# Altium schematic sheet Sheet1.SchDoc
size A
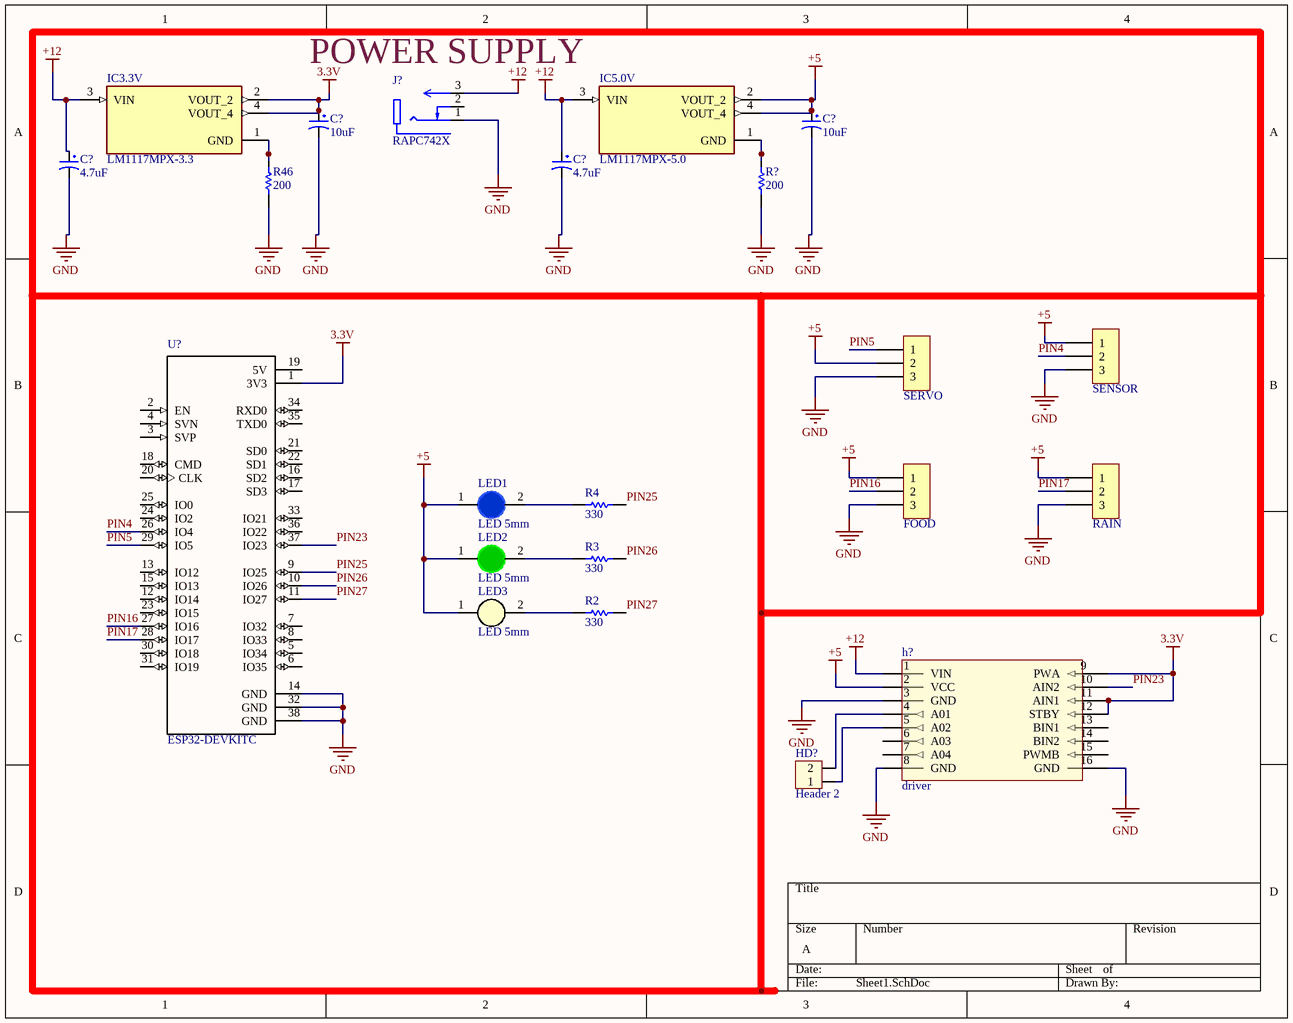
[diagram p0: Sheet1.SchDoc]

## Parts
(Parts that share a designator on the sheet are numbered #1, #2 ... from top to bottom, then left to right.)
C?#1  10uF  [tu hoa 4mm]
C?#2  10uF  [tu hoa 4mm]
C?#3  4.7uF  [tu hoa 4mm]
C?#4  4.7uF  [tu hoa 4mm]
H?#1  SENSOR  [VH3.96M-3]
H?#2  SERVO  [VH3.96M-3]
H?#3  FOOD  [VH3.96M-3]
H?#4  RAIN  [VH3.96M-3]
h?#5  driver  [driver - duplicate3]
HD?  Header 2  [HED2]
IC3.3V  LM1117MPX-3.3  [VREG_LM1117MPX-3.3]
IC5.0V  LM1117MPX-5.0  [VREG_LM1117MPX-3.3]
J?  RAPC742X  [SWITCHCRAFT_RAPC742X]
LED1  LED 5mm  [LED-5MM-BLUE]
LED2  LED 5mm  [LED-5MM-Green]
LED3  LED 5mm  [LED-5MM-WHITE]
R2  value 330  [R1/4W]  (hidden comment: Res1)
R3  value 330  [R1/4W]  (hidden comment: Res1)
R4  value 330  [R1/4W]  (hidden comment: Res1)
R46  value 200  [R1/4W]  (hidden comment: Res1)
R?  value 200  [R1/4W]  (hidden comment: Res1)
U?  ESP32-DEVKITC  [*XCVR_ESP32-DEVKITC]

## Nets
3.3V: C?#1.1 h?#5.9(PWA) h?#5.11(AIN1) h?#5.12(STBY) IC3.3V.2(VOUT_2) IC3.3V.4(VOUT_4) U?.1(3V3)
+5: C?#2.1 H?#1.1 H?#2.2 H?#3.1 H?#4.1 h?#5.2(VCC) IC5.0V.2(VOUT_2) IC5.0V.4(VOUT_4) LED1.1(A) LED2.1(A) LED3.1(A)
+12: C?#3.1 C?#4.1 h?#5.1(VIN) IC3.3V.3(VIN) IC5.0V.3(VIN) J?.3(TIP)
GND: C?#1.2 C?#2.2 C?#3.2 C?#4.2 H?#1.3 H?#2.3 H?#3.3 H?#4.3 h?#5.3(GND) h?#5.8(GND) h?#5.16(GND) J?.1(SLEEVE) R46.1 R?.1 U?.14(GND) U?.32(GND) U?.38(GND)
PIN4: H?#1.2 U?.26(IO4)
PIN5: H?#2.1 U?.29(IO5)
PIN16: H?#3.2 U?.27(IO16)
PIN17: H?#4.2 U?.28(IO17)
PIN23: h?#5.10(AIN2) U?.37(IO23)
PIN25: R4.1 U?.9(IO25)
PIN26: R3.1 U?.10(IO26)
PIN27: R2.1 U?.11(IO27)
Neth?#5_4: h?#5.4(A01) HD?.2
Neth?#5_5: h?#5.5(A02) HD?.1
NetIC3.3V_1: IC3.3V.1(GND) R46.2
NetIC5.0V_1: IC5.0V.1(GND) R?.2
NetLED1_2: LED1.2(K) R4.2
NetLED2_2: LED2.2(K) R3.2
NetLED3_2: LED3.2(K) R2.2

Not connected (* = marked no-connect by the designer): h?#5 6(A03) 7(A04) 13(BIN1) 14(BIN2) 15(PWMB); J? 2(SHUNT); U? 2(EN) 3(SVP) 4(SVN) 5(IO34) 6(IO35) 7(IO32) 8(IO33) 12(IO14) 13(IO12) 15(IO13) 16(SD2) 17(SD3) 18(CMD) 19(5V) 20(CLK) 21(SD0) 22(SD1) 23(IO15) 24(IO2) 25(IO0) 30(IO18) 31(IO19) 33(IO21) 34(RXD0) 35(TXD0) 36(IO22)

## Notes on the sheet
- (near J?) POWER SUPPLY

## Library data of the parts
C?#1-C?#4 = Tu Hoa 10uF 16V 4x7: Cắm; So_Chan: 2; Don_Vi: Con; Ten_Linh_Kien: Tụ Hóa 10uF 16V; Ma_Hang: MH006855; Chung_Loai: Cắm; Kieu_Chan: *
H?#1-H?#4 = Header 3P VH3.96 Duc Thang: Cắm; Ten_Linh_Kien: Header 3P XH2.54-3P Đực Thẳng; Don_Vi: Con; Ma_Hang: MH001292; Chung_Loai: Cắm
HD? = Hed2: Header 2 (Green); Value: Header 2
IC3.3V IC5.0V = LM1117MPX-3.3: 800-mA 15-V linear voltage regulator; MF: Texas Instruments; Check_prices: https://www.snapeda.com/parts/LM1117MPX-3.3/Texas+Instruments/view-part/?ref=eda; Value: *; Availability: In Stock; MP: LM1117MPX-3.3; Price: None; Package: SOT-223-4 Texas Instruments; SnapEDA_Link: https://www.snapeda.com/parts/LM1117MPX-3.3/Texas+Instruments/view-part/?ref=snap; Purchase-URL: https://pricing.snapeda.com/search/part/LM1117MPX-3.3/?ref=eda
J? = RAPC742X: Power Barrel Connector Jack - Through Hole, Right Angle; MF: Switchcraft; Purchase-URL: https://pricing.snapeda.com/search/part/RAPC742X/?ref=eda; Package: None; Value: *; Check_prices: https://www.snapeda.com/parts/RAPC742X/Switchcraft+%252F+Conxall/view-part/?ref=eda; SnapEDA_Link: https://www.snapeda.com/parts/RAPC742X/Switchcraft+%252F+Conxall/view-part/?ref=snap; Availability: In Stock; Price: None; MP: RAPC742X
LED1 = LED 5mm Xanh Duong: Cắm; Don_Vi: Con; Ma_Hang: MH008987; Ten_Linh_Kien: Led 5MM Xanh Dương Đục (1000c); Ghi_Chu: *; Kieu_Chan: *; Chung_Loai: Cắm
LED2 = LED 5mm Xanh La: Cắm; Don_Vi: Con; Ma_Hang: MH008969; Ten_Linh_Kien: LED 5MM Phủ Xanh (1000c); Ghi_Chu: *; Kieu_Chan: *; Chung_Loai: Cắm
LED3 = LED 5mm Trang: Cắm; Don_Vi: Con; Ma_Hang: MH008983; Ten_Linh_Kien: Led 5MM Trắng Đục (1000c); Ghi_Chu: *; Kieu_Chan: *; Chung_Loai: Cắm
R2-R4 R46 R? = Res1_4: Resistor; Manufacturer: Generic Components; Class: Passive; Published: 08/06/2000; Publisher: Altium Hobart Technology Centre; SubClass: Resistor
U? = ESP32-DEVKITC: Module: development kit; Ciphering: AES, WPA, WPA2-PSK, WPS; MF: Olimex LTD; Package: None; Availability: Unavailable; SnapEDA_Link: https://www.snapeda.com/parts/ESP32-DEVKITC/Olimex%20LTD/view-part/?ref=snap; MP: ESP32-DEVKITC; Price: None; Value: *